# EasyEDA Pro project ProPrj_红外对射管_2024-08-31.epro

# Schematic 红外避障模块-IR333-PT333
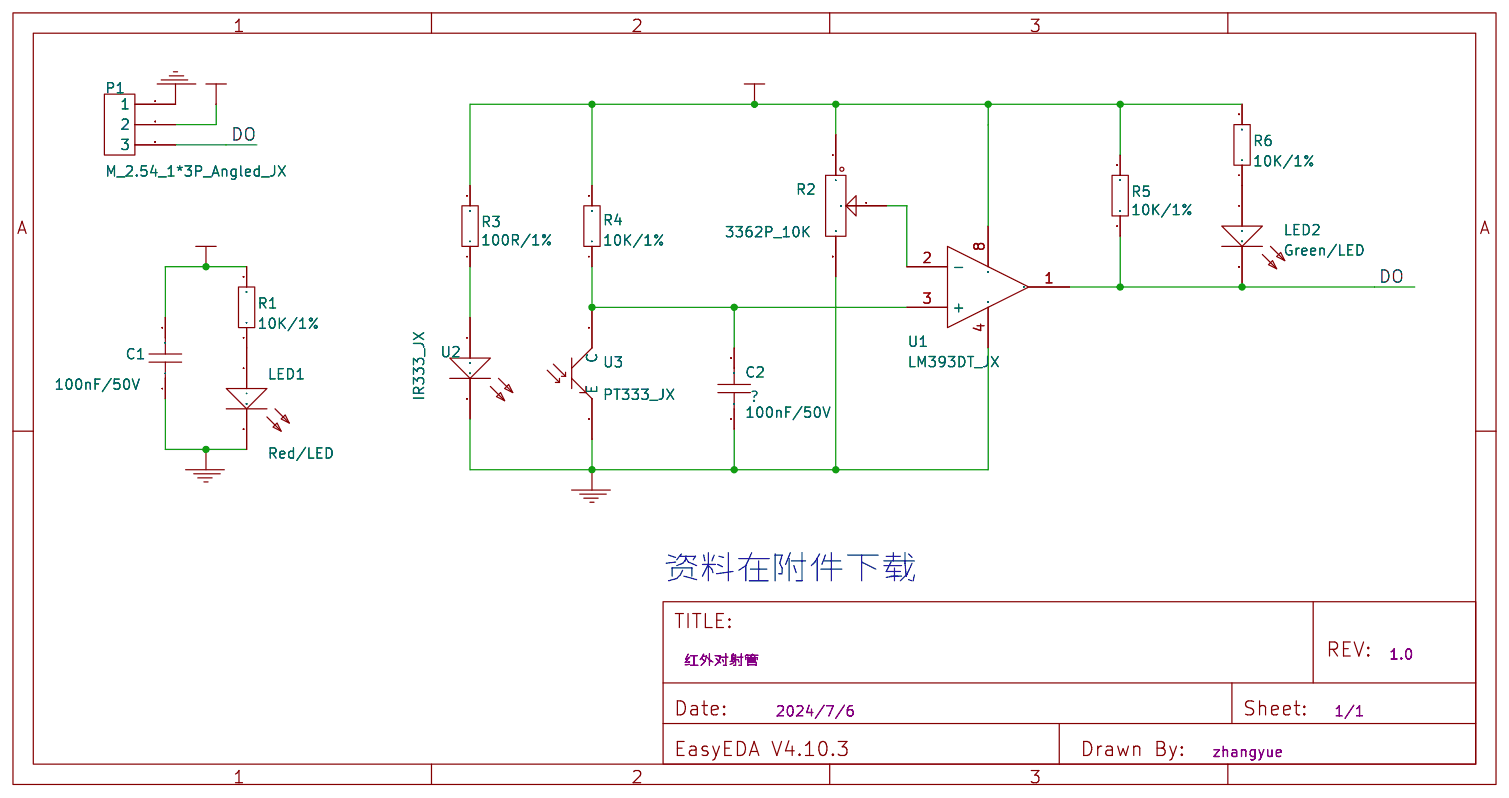
[diagram p0: schematic sheet]

## Parts
C1  100nF/50V  [0603_C_JX]
C2  100nF/50V  [0603_C_JX]
LED1  Red/LED  [0603_D_JX]
LED2  Green/LED  [0603_D_JX]
P1  M_2.54_1*3P_Angled_JX  [2.54-1*3P_tight_JX]
R1  10K/1%  [0603_R_JX]
R2  3362P_10K  [3362P_Corr_JX]
R3  100R/1%  [0603_R_JX]
R4  10K/1%  [0603_R_JX]
R5  10K/1%  [0603_R_JX]
R6  10K/1%  [0603_R_JX]
U1  LM393DT_JX
U2  IR333_JX  [LED_D5.0mm_Horizontal_O3.81_JX]
U3  PT333_JX  [PT333-3B-L-5mm_Horizontal_JX]

## Library data of the parts
C1 C2 = 104: Supplier: LCSC
LED1 = Red: Supplier: LCSC
LED2 = Green: Supplier: LCSC
P1 = 2.54-1*3P_JX: Supplier: LCSC
R1 R4-R6 = 10k: Supplier: LCSC
R2 = 10K_Variable: Supplier: LCSC
R3 = 100R: Supplier: LCSC
U1 = LM393DT_JX: Supplier: LCSC
U2 = INFRARED_IR333C: Supplier: LCSC
U3 = PT333-3B-L: Supplier: LCSC

## Nets
GND: C1.1 C2.1 LED1.2(C) P1.1 R2.3 U1.4(8) U2.2(C) U3.1(E)
VCC: C1.2 P1.2 R1.2 R2.1 R3.2 R4.2 R5.2 R6.2 U1.8
DO: LED2.2(C) P1.3 R5.1 U1.1
R1_1: LED1.1(A) R1.1
R3_1: R3.1 U2.1(A)
R6_1: LED2.1(A) R6.1
U1_2: R2.2 U1.2(-)
U1_3: C2.2 R4.1 U1.3(+) U3.2(C)

## Notes on the sheet
- 资料在附件下载

# Board PCB_InfraredElude-PT333-V1.0_2024-07-06
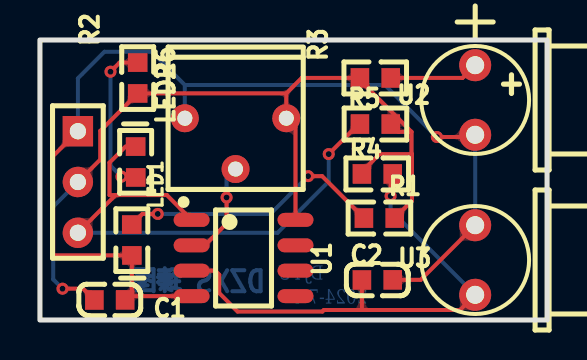
[diagram p1: board, top side]
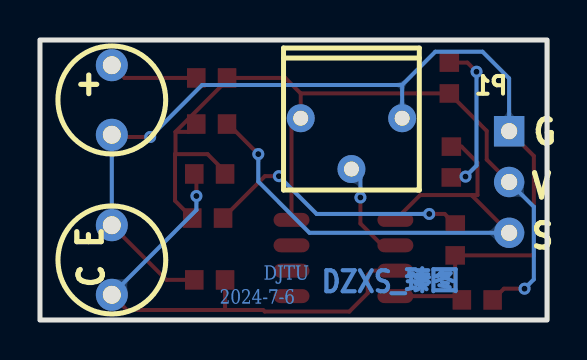
[diagram p2: board, bottom side, seen from below]

Outline 25.4 x 14 mm; copper layers: Top Layer, Bottom Layer. Coordinates in mm from the lower left corner of the outline.
Outline path: rectangle 0,14 25.4,0
Stack: Top Layer 0.035mm / Dielectric1 1.51mm FR4 er 4.5 / Bottom Layer 0.035mm

## Design rules (mm)
spacing Default (default): track to track 0.2, other pairs 0 to 0.2
track width Default (default): min 0.2, default 0.2, max 25.4
differential pair differentialPair (default): width min 0.127, default 0.254, max 2.54; gap min 0.152, default 0.152
via Default (default): diameter min 0.6, default 0.6, max 100.025; hole min 0.3, default 0.3, max 59.995
net GND uses (1)

## Placement (name value [footprint] x y rotation side)
C1  100nF/50V  [0603_C_JX]  3.5 1 180 top
C2  100nF/50V  [0603_C_JX]  16.9 2 180 top
LED1  Red/LED  [0603_D_JX]  4.6 4 90 top
LED2  Green/LED  [0603_D_JX]  4.8 7.9 270 top
P1  M_2.54_1*3P_Angled_JX  [2.54-1*3P_tight_JX]  1.9 6.9 270 top
R1  10K/1%  [0603_R_JX]  17 5.1 0 top
R2  3362P_10K  [3362P_Corr_JX]  9.8 7.55 180 top
R3  100R/1%  [0603_R_JX]  16.8 12.1 180 top
R4  10K/1%  [0603_R_JX]  16.9 7.3 180 top
R5  10K/1%  [0603_R_JX]  16.8 9.8 0 top
R6  10K/1%  [0603_R_JX]  4.9 12.1 270 top
U1  LM393DT_JX  [SOIC8_150MIL_JX]  10.2 3.1 270 top
U2  IR333_JX  [LED_D5.0mm_Horizontal_O3.81_JX]  21.8 11 270 top
U3  PT333_JX  [PT333-3B-L-5mm_Horizontal_JX]  21.8 3 270 top

## Footprints (pads in the part's own frame, mm; a bottom-side part is the same pattern mirrored in y, then rotated)
2.54-1*3P_tight_JX
  rect 1.52x1.52 hole 0.81: 1(-2.54,0)
  round 1.52 hole 0.81: 2(0,0) 3(2.54,0)
0603_C_JX
  rect 0.93x0.98 smd: 1(-0.77,-0.005) 2(0.771,-0.001)
0603_D_JX
  rect 0.93x0.98 smd: 1(0.771,-0.001) 2(-0.77,-0.005)
0603_R_JX
  rect 0.93x0.98 smd: 1(-0.77,-0.003) 2(0.771,-0.003)
3362P_Corr_JX
  round 1.4 hole 0.75: 1(-2.54,-2.54) 2(0,0) 3(2.54,-2.54)
LED_D5.0mm_Horizontal_O3.81_JX
  round 1.6 hole 0.9: 1(-1.74,0) 2(1.74,0)
PT333-3B-L-5mm_Horizontal_JX
  round 1.6 hole 0.9: 1(-1.74,0) 2(1.74,0)
SOIC8_150MIL_JX
  oval 0.7x1.8 smd: 1(-1.905,-2.601) 2(-0.635,-2.601) 3(0.635,-2.601) 4(1.905,-2.601) 5(1.905,2.601) 6(0.635,2.601) 7(-0.635,2.601) 8(-1.905,2.601)

## Nets
As in the schematic.

Pads without a net: U1 5 6 7

## Via types
v1: diameter 0.6, hole 0.3, Top Layer to Bottom Layer, 9 vias

## Routing (per net, layer and track width the routed paths; a pad name or vN(x,y) marks a point on that pad's centre or on a via; arc(x,y) is an arc through that point)
GND: length 52.5
  Top Layer w0.2: 4.6,1.19 LED1.2 0.66,3.23 0.66,8.2 P1.1 ; 4.6,1.19 4.46,1.19 C1.1 ; 4.6,1.19 U1.4 ; U2.2 21.69,9.15 v1(19.88,9.15) ; C2.1 19.07,2.01 U3.1
  Bottom Layer w0.2: 7.26,11.75 5.6,13.41 3.23,13.41 1.9,12.08 P1.1 ; 7.26,11.75 R2.3 ; 7.26,11.75 17.28,11.75 v1(19.88,9.15) ; U2.2 U3.1
VCC: length 44.1
  Top Layer w0.2: 18.61,9.41 18.61,8.32 18.63,8.29 ; 18.61,9.41 17.96,9.41 R5.2 ; 18.61,9.41 16.03,11.99 R3.2 13.11,12.1 12.34,11.33 ; P1.2 3.02,8.02 3.02,9.46 R6.2 12.34,11.33 ; 12.34,11.33 R2.1 12.8,9.63 U1.8 ; 18.63,8.29 17,8.29 16.13,7.42 R4.2 ; 18.63,8.29 18.63,5.96 R1.2 ; C1.2 2.16,1.56 v1(1.13,1.56)
  Bottom Layer w0.2: v1(1.13,1.56) 0.66,2.03 0.66,5.66 P1.2
DO: length 27.7
  Top Layer w0.2: R5.1 15.97,9.8 v1(14.46,8.3) ; 3.76,6.25 3.48,6.25 3.48,7.87 4.29,8.67 LED2.2 ; 3.76,6.25 6.36,6.25 U1.1 ; 3.76,6.25 3.76,6.22 P1.3
  Bottom Layer w0.2: P1.3 11.9,4.36 14.46,6.92 v1(14.46,8.3)
R1_1: length 13.5
  Top Layer w0.2: v1(5.9,5.3) 5.13,5.3 LED1.1 ; v1(13.43,7.19) 14.13,7.19 R1.1
  Bottom Layer w0.2: v1(13.43,7.19) 11.54,5.3 v1(5.9,5.3)
R3_1: length 4.5
  Top Layer w0.2: U2.1 21.16,12.1 R3.1
R6_1: length 7.8
  Top Layer w0.2: LED2.1 4.76,7.17 v1(4.08,7.17) ; R6.1 3.99,12.87 v1(3.53,12.41)
  Bottom Layer w0.2: v1(4.08,7.17) 3.53,7.72 v1(3.53,12.41)
U1_2: length 5.1
  Top Layer w0.2: U1.2 8.26,3.73 9.35,4.82 v1(9.35,6.13)
  Bottom Layer w0.2: R2.2 9.35,7.1 v1(9.35,6.13)
U1_3: length 25.3
  Top Layer w0.2: 16.13,0.5 C2.2 ; 16.13,0.5 21.04,0.5 U3.2 ; 16.13,0.5 14.22,0.5 14.14,0.42 9.9,0.42 8.98,1.34 8.98,2.27 8.78,2.47 U1.3 ; v1(17.56,6.2) 17.56,7.2 R4.1
  Bottom Layer w0.2: v1(17.56,6.2) 17.56,5.5 U3.2

## Copper pours and planes (outline as drawn; the poured copper is in the pictures)
GND on Top Layer: -0.8,14.9 28.1,14.9 28.1,-1.6 -0.8,-1.6
GND on Bottom Layer: -2.1,15.8 28.9,15.8 28.9,-1.3 -2.1,-1.3

Small or netless copper shapes (teardrops, artwork), in the pictures only: 52 on Top Layer, 18 on Bottom Layer

## Text on the board
Bottom Layer: DJTU | 2024-7-6 | DZXS_臻图
Bottom Silkscreen Layer: C | E | G | V | S | +
Top Silkscreen Layer: +
